# Altium schematic sheet DualUSB2.0_CON.SchDoc
size 420 x 297 mm; SheetNumber: 5; SheetTotal: 11; ModifiedBy: -; CheckedDate: -; Title2: Title 2; DivGrp: WUT ISE; Designer: G.Kasprowicz
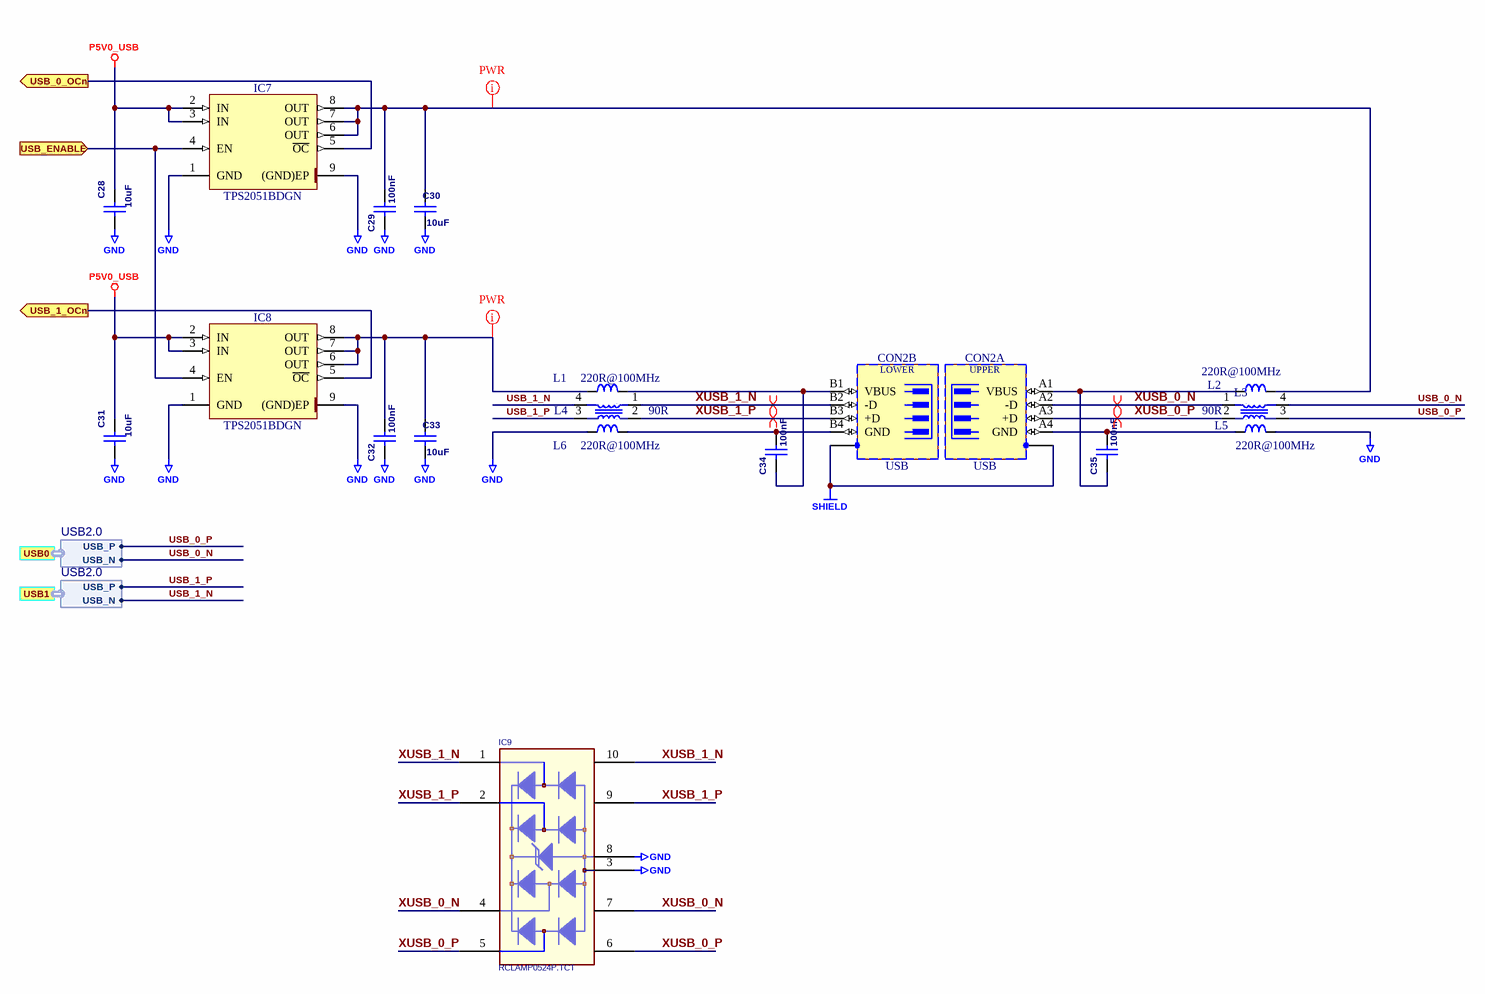
[diagram p0: DualUSB2.0_CON.SchDoc]

## Parts
C28  10uF  [CAPC2012X135N]
C29  100nF  [CAPC1005X55N]
C30  10uF  [CAPC2012X135N]
C31  10uF  [CAPC2012X135N]
C32  100nF  [CAPC1005X55N]
C33  10uF  [CAPC2012X135N]
C34  100nF  [CAPC1005X55N]
C35  100nF  [CAPC1005X55N]
CON2  USB  [FCI_72309-8034BLF]  (parts A,B of 2)
IC7  TPS2051BDGN  [SOP65P490X110-9N-R157X189]
IC8  TPS2051BDGN  [SOP65P490X110-9N-R157X189]
IC9  RCLAMP0524P.TCT  [SMDARRAYC_10P4C]
L1  220R@100MHz  [INDC2012X105N]
L2  220R@100MHz  [INDC2012X105N]
L3  value 90R  [DLSCM0805]  (hidden comment: DLSCM0805-900M or DLW21SN900SQ2L)
L4  value 90R  [DLSCM0805]  (hidden comment: DLSCM0805-900M or DLW21SN900SQ2L)
L5  220R@100MHz  [INDC2012X105N]
L6  220R@100MHz  [INDC2012X105N]

## Ports
USB0 (harness USB2.0), USB1 (harness USB2.0), USB_0_OCn (out), USB_1_OCn (out), USB_ENABLE (in)

## Harnesses
USB2.0: USB_P, USB_N

## Nets
GND: C28.1 C29.1 C30.1 C31.1 C32.1 C33.1 IC7.1(GND) IC7.9((GND)EP) IC8.1(GND) IC8.9((GND)EP) IC9.3 IC9.8 L5.2 L6.1
P5V0_USB: C28.2 C31.2 IC7.2(IN) IC7.3(IN) IC8.2(IN) IC8.3(IN)
SHIELD: CON2.SH(SHIELD)
USB_0_N: L3.4 ; port USB0.USB_N
USB_0_OCn: IC7.5(~{OC}) ; port USB_0_OCn
USB_0_P: L3.3 ; port USB0.USB_P
USB_1_N: L4.4 ; port USB1.USB_N
USB_1_OCn: IC8.5(~{OC}) ; port USB_1_OCn
USB_1_P: L4.3 ; port USB1.USB_P
USB_ENABLE: IC7.4(EN) IC8.4(EN) ; port USB_ENABLE
XUSB_0_N: CON2.A2(-D) IC9.4 IC9.7 L3.1
XUSB_0_P: CON2.A3(+D) IC9.5 IC9.6 L3.2
XUSB_1_N: CON2.B2(-D) IC9.1 IC9.10 L4.1
XUSB_1_P: CON2.B3(+D) IC9.2 IC9.9 L4.2
NetC29_2: C29.2 C30.2 IC7.6(OUT) IC7.7(OUT) IC7.8(OUT) L2.2
NetC32_2: C32.2 C33.2 IC8.6(OUT) IC8.7(OUT) IC8.8(OUT) L1.1
NetC34_1: C34.1 CON2.B1(VBUS) L1.2
NetC34_2: C34.2 CON2.B4(GND) L6.2
NetC35_1: C35.1 CON2.A1(VBUS) L2.1
NetC35_2: C35.2 CON2.A4(GND) L5.1

## Layout directives
differential pair: XUSB_0_N, XUSB_0_P, XUSB_1_N, XUSB_1_P
net class PWR: NetC29_2, NetC32_2

## Notes on the sheet
- Project/Equipment
- Document
- Designer
- Drawn by
- Check.by
- Copyright WUT ISE 2024.
  This documentation describes Open Hardware and is licensed under the CERN OHL v.2. You may redistribute and modify this documentation under the terms of the CERN OHL v.2. (http://ohwr.org/CERNOHL). This documentation is distributed WITHOUT ANY EXPRESS OR IMPLIED WARRANTY, INCLUDING OF MERCHANTABILITY, SATISFACTORY QUALITY AND FITNESS FOR A PARTICULAR PURPOSE. Please see the CERN OHL v.2 for applicable conditions.
- Contact
- File
- Last Mod.
- Print Date
- Sheet
- Size
- A3
- of
- Rev
- (in symbol FCI_72309-8034BLF, part A) UPPER
- (in symbol FCI_72309-8034BLF, part B) LOWER

## Library data of the parts
C28 C30 C31 C33 = CC0805_10UF_10V_10%_X7R: Non-polarised capacitor; Part Description: SMD Multilayer Chip Ceramic Capacitor; Manufacturer: GENERIC; Manufacturer1 Part Number: GRM21BR71A106KE51L; Voltage: 10V; TC: X7R; Tolerance: ±10%; Table: Capacitors SMD; Part Number: CC0805_10UF_10V_10%_X7R; Component Kind: Standard; Component Type: Standard; Pin Count: 2; Value: 10uF; Status: Preferred; Manufacturer Part Number: CC0805_10UF_10V_10%_X7R; Case: 0805; Mounted: Yes; Socket: No; SMD: Yes; Manufacturer1 Example: MURATA; Manufacturer1 ComponentHeight: 1.35mm; HelpURL: \\cern.ch\dfs\Applications\Altium\Datasheets\CC0805_X7R_MURATA.pdf; Author: CERN DEM JLC; CreateDate: 2012-04-30; LatestRevisionDate: 2012-04-30
C29 C32 C34 C35 = CC0402_100NF_16V_10%_X7R: Non-polarised capacitor; Part Description: SMD Multilayer Chip Ceramic Capacitor; Manufacturer: GENERIC; Manufacturer1 Part Number: GRM155R71C104KA88D; Voltage: 16V; TC: X7R; Tolerance: ±10%; Part Number: CC0402_100NF_16V_10%_X7R; Component Kind: Standard; Component Type: Standard; Pin Count: 2; Value: 100nF; Status: Not Recommended; Manufacturer Part Number: CC0402_100NF_16V_10%_X7R; Case: 0402; Mounted: Yes; Socket: No; SMD: Yes; Sense: No; Manufacturer1 Example: MURATA; Manufacturer1 ComponentHeight: 0.55mm; HelpURL: \\cern.ch\dfs\Applications\Altium\Datasheets\CC0402_X7R_MURATA_GRM.pdf; Author: CERN DEM JLC; CreateDate: 05/12/2013; LatestRevisionDate: 03/12/2007
CON2 = FCI_72309-8034BLF: Dual 4 Pin + 1 Shield USB Receptacle; Part Description: Dual Right Angle USB Type A Receptacle, Through Hole, 30u GXT Contact, 8 Pins, Shield With Bright Tin Plating, 1.57 mm PCB, White HSG; Manufacturer: FCI; Part Number: FCI_72309-8034BLF; Component Kind: Standard; Component Type: Standard; Pin Count: 9; Family: USB; Mounted: Yes; Socket: No; SMD: No; Status: None; Manufacturer Part Number: 72309-8034BLF; ComponentHeight: 15.5mm; HelpURL: \\cern.ch\dfs\Applications\Altium\Datasheets\FCI_72309-8034BLF.pdf; Author: CERN DEM JLC; CreateDate: 2011-03-23; LatestRevisionDate: 2011-03-23; Table: FCI
IC7 IC8 = TPS2051BDGN: One Channel, Current-Limited, Power-Distribution Switches; Part Description: One Channel, Current-Limited (500mA), Power-Distribution Switches; Manufacturer: TEXAS INSTRUMENTS; PressFit: No; Bonding: No; Part Number: TPS2051BDGN; Component Kind: Standard; Component Type: Standard; Device: TPS2051BDGN; PackageDescription: SOP, 0.65mm Pitch; 8 Pin, 3.00mm W X 3.00mm L X 1.10mm H body (w/Thermal Tab 1.57 X 1.89mm), IPC Medium Density; Manufacturer Part Number: TPS2051BDGN; Pin Count: 8; Case: SSOP8; Mounted: Yes; Socket: No; SMD: Yes; Sense: No; ComponentHeight: 1.1mm; Author: CERN DEM BC; HelpURL: \\cern.ch\dfs\Applications\Altium\Datasheets\TPS2051BDGN.pdf; CreateDate: 06.07.2020; LatestRevisionDate: 06.07.2020
IC9 = D_TVS_RCLAMP0524P: DIODE,RCLAMP0524P,SEMTECH; Specification: SMD,ESD COMPONENT,ROHS
L1 L2 L5 L6 = IND0805_MURATA_BLM21PG221SN1D: Inductor; Part Description: SMD EMIFIL Suppression Chip Ferrite Bead; Manufacturer: MURATA; Power: 2A; Resistance: 0.05R; Tolerance: ±25%; Table: Inductors SMD; Part Number: IND0805_MURATA_BLM21PG221SN1D; Component Kind: Standard; Component Type: Standard; Pin Count: 2; Value: 220R@100MHz; Status: None; Manufacturer Part Number: BLM21PG221SN1D; Case: 0805; Mounted: Yes; Socket: No; SMD: Yes; ComponentHeight: 1.05mm; HelpURL: \\cern.ch\dfs\Applications\Altium\Datasheets\IND0402_MURATA_BLM21P.pdf; Author: CERN DEM JLC; CreateDate: 2010-01-25; LatestRevisionDate: 2010-01-25
L3 L4 = L_CMC_DLSCM0805_90R: Common Mode Choke 90R